# EAGLE schematic zamekKodowy (EAGLE 6.3)
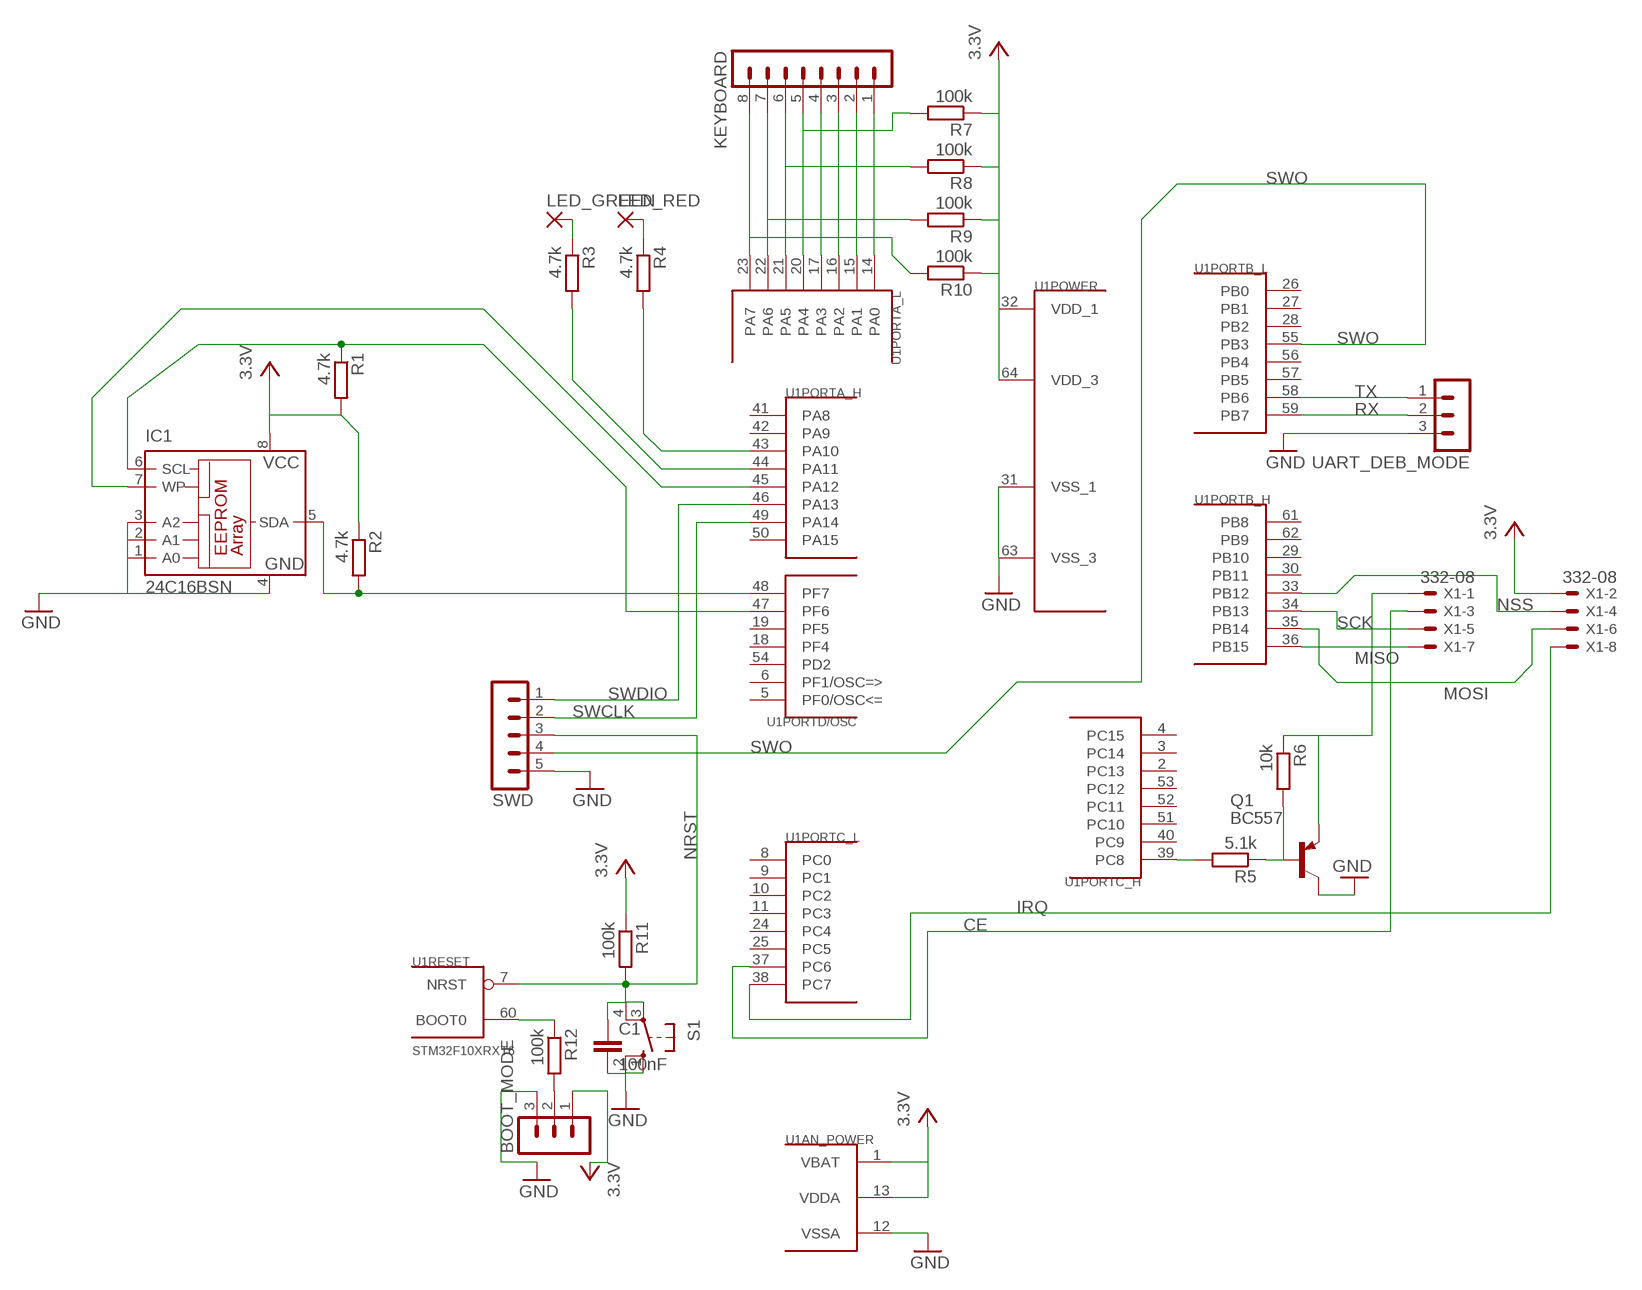
[diagram p0: schematic, sheet 1]

## Parts
BOOT_MODE  MA03-1  [MA03-1]
C1  100nF  C-EUC1206K  [C1206K]
IC1  24C16BSN  [SO-08]
KEYBOARD  MA08-1  [MA08-1]
LED_GREEN  2,54/0,9  [2,54/0,9]
LED_RED  2,54/0,9  [2,54/0,9]
Q1  BC557  [TO92]
R1  4.7k  R-EU_M2309  [M2309]
R2  4.7k  R-EU_M2309  [M2309]
R3  4.7k  R-EU_M2309  [M2309]
R4  4.7k  R-EU_M2309  [M2309]
R5  5.1k  R-EU_M2309  [M2309]
R6  10k  R-EU_M2309  [M2309]
R7  100k  R-EU_M2309  [M2309]
R8  100k  R-EU_M2309  [M2309]
R9  100k  R-EU_M2309  [M2309]
R10  100k  R-EU_M2309  [M2309]
R11  100k  R-EU_M2309  [M2309]
R12  100k  R-EU_M2309  [M2309]
S1  10-XX  [B3F-10XX]
SWD  MA05-1  [MA05-1]
U1  STM32F10XRXT6  [TQFP64]
UART_DEB_MODE  MA03-1  [MA03-1]
X1  332-08  [332-08]

## Nets
CE: U1.37(PORTC_L:PC6) X1.3
GND: BOOT_MODE.3 C1.2 IC1.1(A0) IC1.2(A1) IC1.3(A2) IC1.4(GND) Q1.3(C) S1.1(S) S1.2(S1) SWD.5 U1.12(AN_POWER:VSSA) U1.31(POWER:VSS_1) U1.63(POWER:VSS_3) UART_DEB_MODE.3
IRQ: U1.38(PORTC_L:PC7) X1.8
MISO: U1.36(PORTB_H:PB15) X1.7
MOSI: U1.35(PORTB_H:PB14) X1.6
N$1: IC1.5(SDA) R2.2 U1.48(PORTD/OSC:PF7)
N$2: IC1.6(SCL) R1.1 U1.47(PORTD/OSC:PF6)
N$3: IC1.7(WP) U1.45(PORTA_H:PA12)
N$4: R3.2 U1.44(PORTA_H:PA11)
N$5: R4.2 U1.43(PORTA_H:PA10)
N$6: LED_GREEN.1(P) R3.1
N$7: LED_RED.1(P) R4.1
N$8: Q1.2(B) R5.1 R6.2
N$9: KEYBOARD.8 R10.2 U1.23(PORTA_L:PA7)
N$10: R5.2 U1.39(PORTC_H:PC8)
N$11: Q1.1(E) R6.1 X1.1
N$12: KEYBOARD.7 R9.2 U1.22(PORTA_L:PA6)
N$13: KEYBOARD.6 R8.2 U1.21(PORTA_L:PA5)
N$14: KEYBOARD.5 R7.2 U1.20(PORTA_L:PA4)
N$15: KEYBOARD.4 U1.17(PORTA_L:PA3)
N$16: KEYBOARD.3 U1.16(PORTA_L:PA2)
N$17: KEYBOARD.2 U1.15(PORTA_L:PA1)
N$18: KEYBOARD.1 U1.14(PORTA_L:PA0)
N$19: R12.1 U1.60(RESET:BOOT0)
N$20: BOOT_MODE.2 R12.2
NRST: C1.1 R11.2 S1.3(P) S1.4(P1) SWD.3 U1.7(RESET:NRST)
NSS: U1.33(PORTB_H:PB12) X1.4
RX: U1.59(PORTB_L:PB7) UART_DEB_MODE.2
SCK: U1.34(PORTB_H:PB13) X1.5
SWCLK: SWD.2 U1.49(PORTA_H:PA14)
SWDIO: SWD.1 U1.46(PORTA_H:PA13)
SWO: SWD.4 U1.55(PORTB_L:PB3)
TX: U1.58(PORTB_L:PB6) UART_DEB_MODE.1
VCC: BOOT_MODE.1 IC1.8(VCC) R1.2 R2.1 R7.1 R8.1 R9.1 R10.1 R11.1 U1.1(AN_POWER:VBAT) U1.13(AN_POWER:VDDA) U1.32(POWER:VDD_1) U1.64(POWER:VDD_3) X1.2 ; supply symbol labelled 3.3V
Unconnected: U1.2(PORTC_H:PC13) U1.3(PORTC_H:PC14) U1.4(PORTC_H:PC15) U1.5(PORTD/OSC:PF0/OSC<=) U1.6(PORTD/OSC:PF1/OSC=>) U1.8(PORTC_L:PC0) U1.9(PORTC_L:PC1) U1.10(PORTC_L:PC2) U1.11(PORTC_L:PC3) U1.18(PORTD/OSC:PF4) U1.19(PORTD/OSC:PF5) U1.24(PORTC_L:PC4) U1.25(PORTC_L:PC5) U1.26(PORTB_L:PB0) U1.27(PORTB_L:PB1) U1.28(PORTB_L:PB2) U1.29(PORTB_H:PB10) U1.30(PORTB_H:PB11) U1.40(PORTC_H:PC9) U1.41(PORTA_H:PA8) U1.42(PORTA_H:PA9) U1.50(PORTA_H:PA15) U1.51(PORTC_H:PC10) U1.52(PORTC_H:PC11) U1.53(PORTC_H:PC12) U1.54(PORTD/OSC:PD2) U1.56(PORTB_L:PB4) U1.57(PORTB_L:PB5) U1.61(PORTB_H:PB8) U1.62(PORTB_H:PB9)

## Library data of the parts
BOOT_MODE UART_DEB_MODE = con-lstb:MA03-1: PIN HEADER; OC_FARNELL: unknown; OC_NEWARK: unknown
C1 = rcl:C-EU: CAPACITOR, European symbol
IC1 = microchip:24*: Serial EEPROM I2C; MPN: AT24C16BN-SH-B; OC_FARNELL: 1362651; OC_NEWARK: 50M3324
KEYBOARD = con-lstb:MA08-1: PIN HEADER; OC_FARNELL: unknown; OC_NEWARK: unknown
LED_GREEN LED_RED = wirepad:2,54/0,9: THROUGH-HOLE PAD
Q1 = transistor-pnp:BC557: PNP Transistor
R1-R12 = rcl:R-EU_: RESISTOR, European symbol
S1 = switch-omron:10-XX: OMRON SWITCH; MPN: B3F-1000; OC_FARNELL: 176432; OC_NEWARK: 36M3542
SWD = con-lstb:MA05-1: PIN HEADER; OC_FARNELL: unknown; OC_NEWARK: unknown
U1 = stm32F051R8:STM32F10XRXT6: STM32F101/103 64pin LQFP
X1 = con-garry:332-08: 8 Pin - 2mm Dual Row Source: www.mpe-connector.de / garry_shortform_2012.pdf